# Altium schematic sheet Mid.SchDoc
size A4
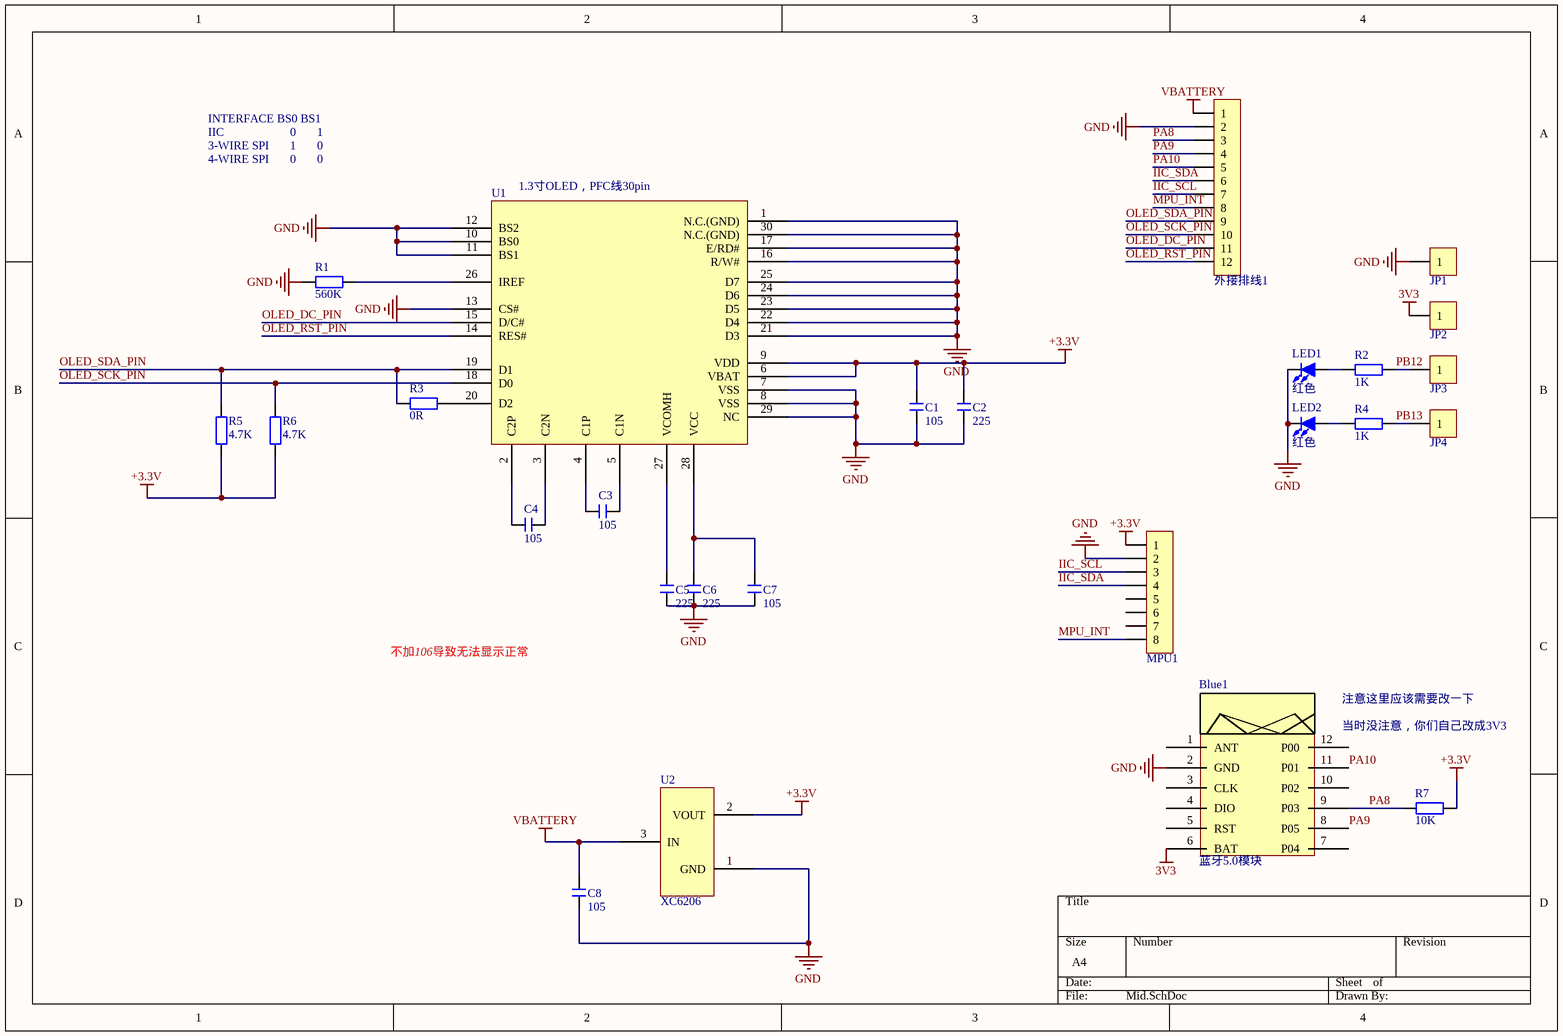
[diagram p0: Mid.SchDoc]

## Parts
Blue1  蓝牙5.0模块  [PW02]
C1  105  [C 0805]
C2  225  [C 0805]
C3  105  [C 0805]
C4  105  [C 0805]
C5  225  [C 0805]
C6  225  [C 0805]
C7  105  [C 0805]
C8  105  [C 0805]
JP1  HDR-1X1  [HDR-1X1]  (value not drawn)
JP2  HDR-1X1  [HDR-1X1]  (value not drawn)
JP3  HDR-1X1  [HDR-1X1]  (value not drawn)
JP4  HDR-1X1  [HDR-1X1]  (value not drawn)
LED1  红色  [LED 0805B]
LED2  红色  [LED 0805G]
MPU1  HDR-1X8  [HDR-1X8]  (value not drawn)
R1  560K  [R 0805]
R2  1K  [R 0805]
R3  0R  [R 0805]
R4  1K  [R 0805]
R5  4.7K  [R 0805]
R6  4.7K  [R 0805]
R7  10K  [R 0805]
U1  1.3寸OLED，PFC线30pin  [1.3寸OLED-PFC]
U2  XC6206  [SOT23-3N]
外接排线1  HDR-1X12  [HDR-1X12]  (value not drawn)

## Nets
3V3: Blue1.6(BAT) JP2.1
+3.3V: C1.2 C2.2 MPU1.1 R5.2 R6.2 R7.2 U1.6(VBAT) U1.9(VDD) U2.2(VOUT)
GND: Blue1.2(GND) C1.1 C2.1 C5.1 C6.1 C7.1 C8.2 JP1.1 LED1.2(K) LED2.2(K) MPU1.2 R1.1 U1.1(N.C.(GND)) U1.7(VSS) U1.8(VSS) U1.10(BS0) U1.11(BS1) U1.12(BS2) U1.13(CS#) U1.16(R/W#) U1.17(E/RD#) U1.21(D3) U1.22(D4) U1.23(D5) U1.24(D6) U1.25(D7) U1.29(NC) U1.30(N.C.(GND)) U2.1(GND) 外接排线1.2
VBATTERY: C8.1 U2.3(IN) 外接排线1.1
IIC_SCL: MPU1.3 外接排线1.7
IIC_SDA: MPU1.4 外接排线1.6
MPU_INT: MPU1.8 外接排线1.8
OLED_DC_PIN: U1.15(D/C#) 外接排线1.11
OLED_RST_PIN: U1.14(RES#) 外接排线1.12
OLED_SCK_PIN: R6.1 U1.18(D0) 外接排线1.10
OLED_SDA_PIN: R3.1 R5.1 U1.19(D1) 外接排线1.9
PA8: Blue1.9(P03) R7.1 外接排线1.3
PA9: Blue1.8(P05) 外接排线1.4
PA10: Blue1.11(P01) 外接排线1.5
PB12: JP3.1 R2.2
PB13: JP4.1 R4.2
NetC3_1: C3.1 U1.5(C1N)
NetC3_2: C3.2 U1.4(C1P)
NetC4_1: C4.1 U1.3(C2N)
NetC4_2: C4.2 U1.2(C2P)
NetC5_2: C5.2 U1.27(VCOMH)
NetC6_2: C6.2 C7.2 U1.28(VCC)
NetLED1_1: LED1.1(A) R2.1
NetLED2_1: LED2.1(A) R4.1
NetR1_2: R1.2 U1.26(IREF)
NetR3_2: R3.2 U1.20(D2)

Not connected (* = marked no-connect by the designer): Blue1 1(ANT) 3(CLK) 4(DIO) 5(RST) 7(P04) 10(P02) 12(P00); MPU1 5 6 7

## Notes on the sheet
- INTERFACE BS0 BS1
- IIC                      0       1
- 3-WIRE SPI       1       0
- 4-WIRE SPI       0       0
- 不加106导致无法显示正常
- (near Blue1) 注意这里应该需要改一下
- (near Blue1) 当时没注意，你们自己改成3V3

## Library data of the parts
Blue1 = PW02
C1-C8 = C: 无极性贴片电容; 版权归属: 源创客; BOM名称: 无极性贴片电容; 学习资源: www.ooocke.com
JP1-JP4 = Header 1: 1P接插件; 版权归属: 源创客; BOM名称: 1P接插件; 学习资源: www.ooocke.com
LED1 LED2 = LED-SMD: 贴片LED; 版权归属: 源创客; BOM名称: 贴片LED; 学习资源: www.ooocke.com
MPU1 = Header 8: 8P接插件; 版权归属: 源创客; BOM名称: 8P接插件; 学习资源: www.ooocke.com
R1-R7 = R: 贴片电阻; 版权归属: 源创客; BOM名称: 贴片电阻; 学习资源: www.ooocke.com
U2 = XC6206: 稳压芯片
外接排线1 = Header 12: 12P接插件; 版权归属: 源创客; BOM名称: 12P接插件; 学习资源: www.ooocke.com